# EAGLE design Poseidon (EAGLE 9.6.2)
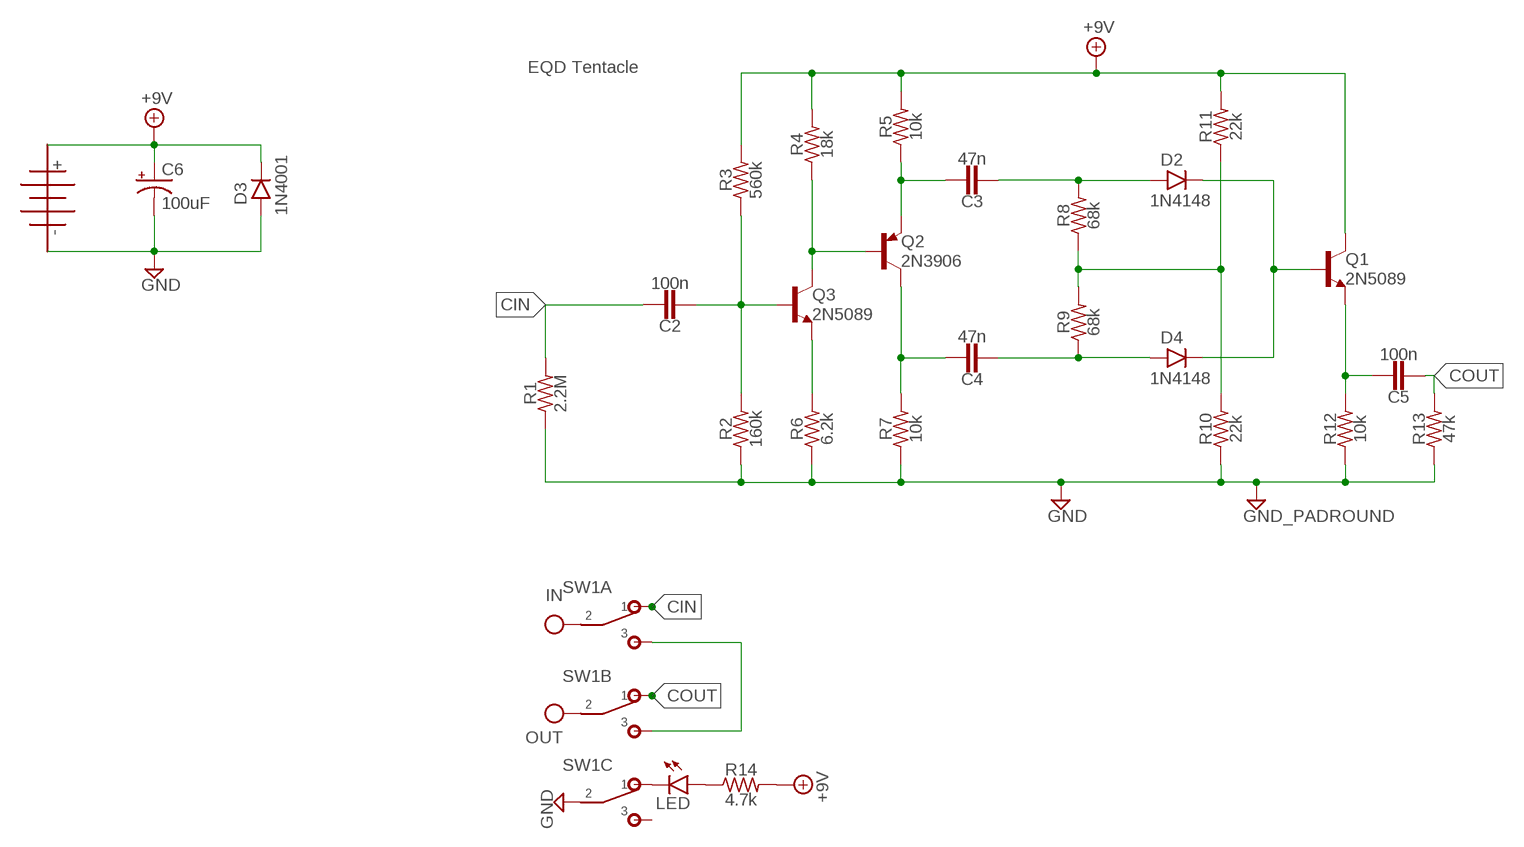
[diagram p0: schematic, sheet 1]

## Parts
C2  100n  CAP.2  [0.2".SML]
C3  47n  CAP.2  [0.2".SML]
C4  47n  CAP.2  [0.2".SML]
C5  100n  CAP.2  [0.2".SML]
C6  100uF  0631  [063_025]
D2  1N4148  DO35.3  [DO35-3]
D3  1N4001  DO41.3  [DO41-3]
D4  1N4148  DO35.3  [DO35-3]
DC  BATTERYBAT2  [BATTERY2]
GND  GND_PADROUND  [ROUND]
IN  IN  [SQUARE]
LED  LED3MM  [LED3MM]
OUT  OUT  [SQUARE]
Q1  2N5089  2N5088  [TO92]
Q2  2N3906  2N5087  [TO92]
Q3  2N5089  2N5088  [TO92]
R1  2.2M  R.3B  [0.3".B]
R2  160k  R.3B  [0.3".B]
R3  560k  R.3B  [0.3".B]
R4  18k  R.3B  [0.3".B]
R5  10k  R.3B  [0.3".B]
R6  6.2k  R.3B  [0.3".B]
R7  10k  R.3B  [0.3".B]
R8  68k  R.3B  [0.3".B]
R9  68k  R.3B  [0.3".B]
R10  22k  R.3B  [0.3".B]
R11  22k  R.3B  [0.3".B]
R12  10k  R.3B  [0.3".B]
R13  47k  R.3B  [0.3".B]
R14  4.7k  R.3B  [0.3".B]
SW1  3PDT  [3PDT]

## Nets
+9V: C6.+ D3.C DC.P$1 Q1.1(C) R3.2 R4.2 R5.2 R11.2 R14.2
CIN: C2.1 R1.2 SW1.A1
COUT: C5.2 R13.2 SW1.B1
GND: C6.- D3.A DC.P$2 GND.1(GND) R1.1 R2.1 R6.1 R7.1 R10.1 R12.1 R13.1 SW1.C2
IN: IN.1(IN) SW1.A2
N$1: SW1.A3 SW1.B3
N$2: C2.2 Q3.2(B) R2.2 R3.1
N$3: LED.K(C) SW1.C1
N$4: Q3.3(E) R6.2
N$5: LED.A R14.1
N$6: Q2.2(B) Q3.1(C) R4.1
N$7: C3.1 Q2.3(E) R5.1
N$9: C4.1 Q2.1(C) R7.2
N$10: C4.2 D4.A R9.1
N$11: R8.1 R9.2 R10.2 R11.1
N$12: C3.2 D2.A R8.2
N$14: D2.C D4.C Q1.2(B)
N$16: C5.1 Q1.3(E) R12.2
OUT: OUT.1(OUT) SW1.B2
Unconnected: SW1.C3

## Notes on the sheet
- EQD Tentacle

## Library data of the parts
C2-C5 = caps-film:CAP: For Ceramic, Film, MLCC caps
C6 = caps-elec:063: 33 - 220uF Xicon values at Mouser.com 10V: 220uF; 16V: 100uF; 25V: 100uF; 50V: 33uF
D2 D4 = diodes:DO35: DO-35 Package Diodes: 1N914
D3 = diodes:DO41: DO-41 Package Diodes: 1N4001 - 1N40019 Zener Diodes: 1N4728 - 1N4764
DC = jacks:BATTERY
GND = supply pins:GND_PAD: Ground use this to hook up ground connections throughout a schematic instead of running wire automatically labels the net "GND"
IN = supply pins:IN: Input obsolete: use Mark instead and label net schematic input label without circuit board terminal/pad labels net "IN" provided as complement to OUT (rarely used)
LED = diodes:LED
OUT = supply pins:OUT: Output obsolete: use Mark instead and label net output label without circuit board terminal/pad commonly used as output label on 2nd lug of a potentiometer
Q1 Q3 = transistors-BJT:2N5088: NPN - 2n5088, 2n5089, 2n3904, MPSA18 [C]-B-E pinout 2n5088: http://smallbear-electronics.mybigcommerce.com/transistor-2n5088/ 2n5089: http://smallbear-electronics.mybigcommerce.com/transistor-2n5089/ 2n5089: http://smallbear-electronics.mybigcommerce.com/transistor-2n5089-motorola/ 2n3904: http://smallbear-electronics.mybigcommerce.com/transistor-2n3904/ MPSA18: http://smallbear-electronics.mybigcommerce.com/transistor-mpsa18/
Q2 = transistors-BJT:2N5087: PNP - 2n5087, 2n3906 [C]-B-E pinout 2n5087: http://smallbear-electronics.mybigcommerce.com/transistor-2n5087/ 2n3906: http://smallbear-electronics.mybigcommerce.com/transistor-2n3906/
R1-R14 = resistors:R: 1/8W, 1/4W and 1W resistors
SW1 = switches:3PDT: Mountain Switch 108-1M31T1B1M1QE-EVX https://www.mouser.com/ProductDetail/Mountain-Switch/108-1M31T1B1M1QE-EVX?qs=sGAEpiMZZMvudeGI7i40XO%252BnGhp8Hy%252BJe46O%2FBjy5XE%3D

## Board
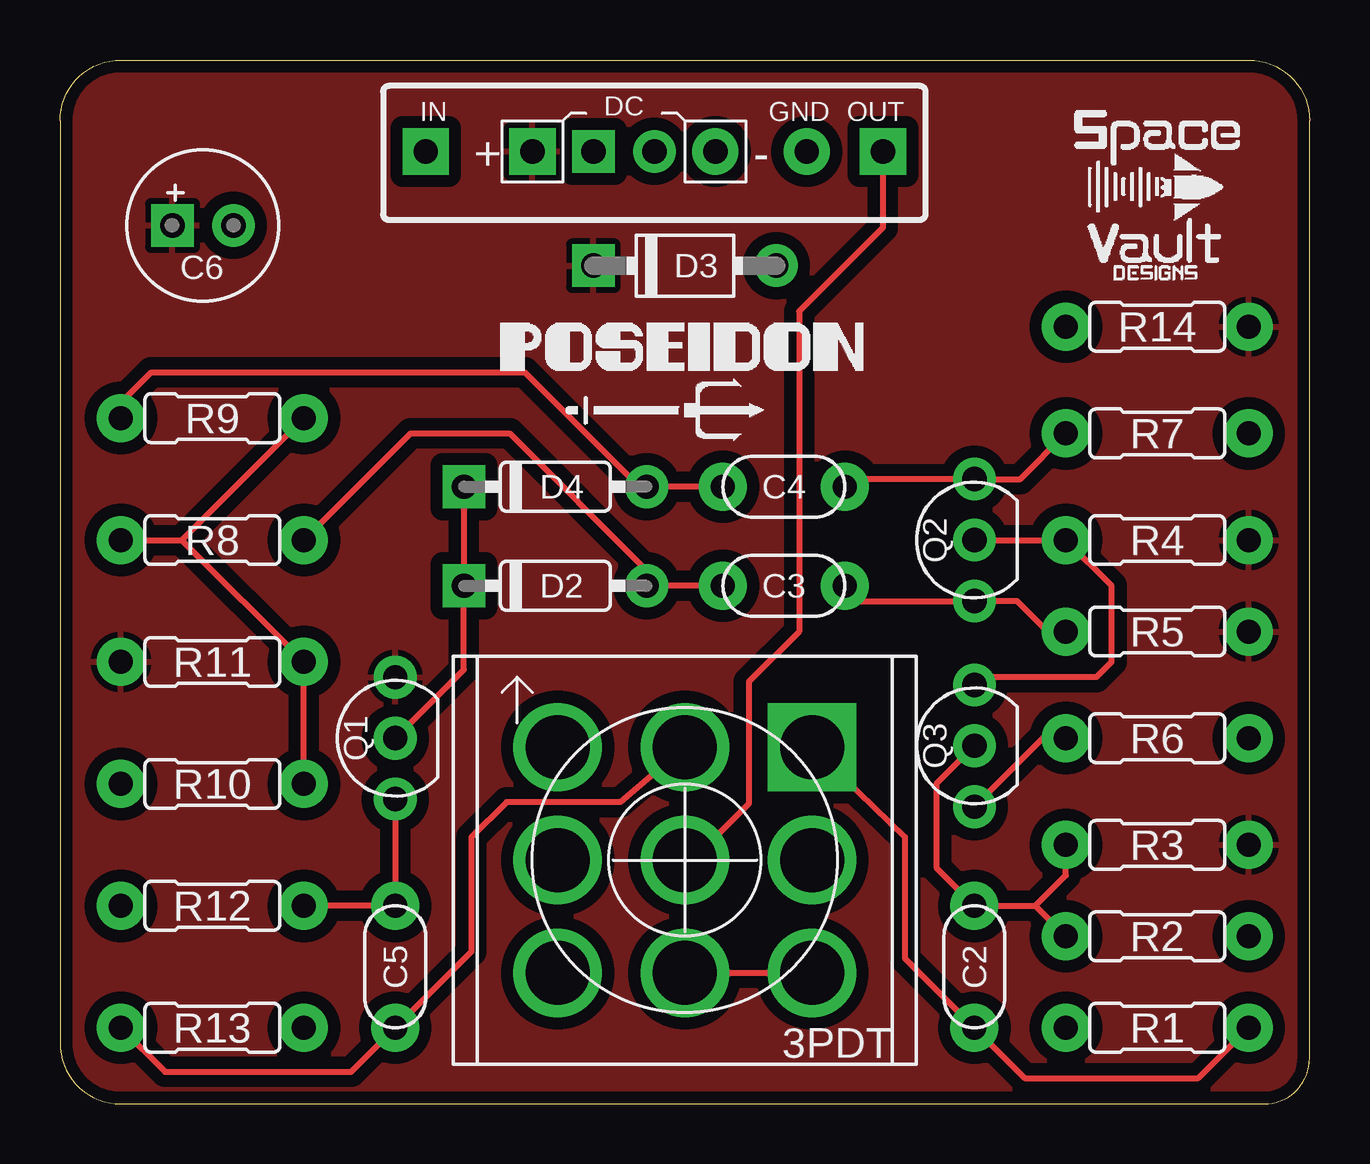
[diagram p1: board, top side]
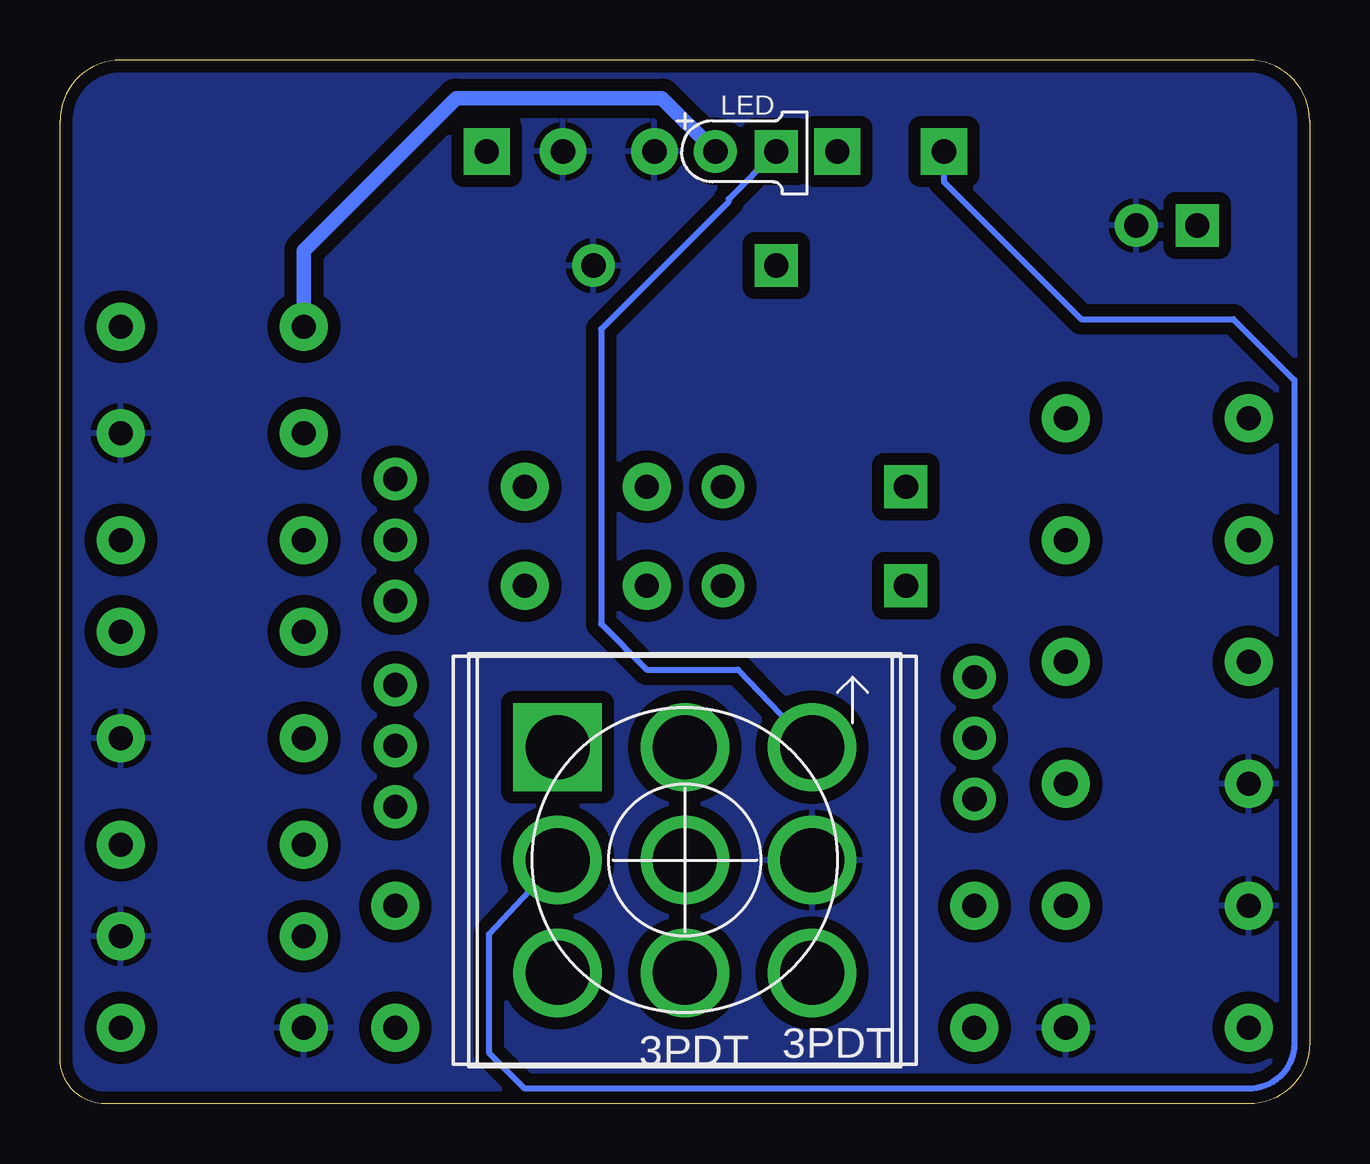
[diagram p2: board, bottom side, seen from below]

Size 52.07 x 43.5 mm. Coordinates in mm from the lower left corner, seen from the top.
Outline: 0,2.54 arc90 2.54,0 50.17,0 arc90 52.07,1.9 52.07,40.96 arc90 49.53,43.5 2.54,43.5 arc90 0,40.96 0,2.54
Copper layers (1*16): Top 0.035mm / dielectric 1.6mm / Bottom 0.035mm
Design rules "Elecrow_2-layer_PCB_eagle_rule": minimum track width 6mil, minimum drill 12mil, track to track 6mil, track to pad 6mil, pad to pad 6mil, via to via 8mil, smd to smd 0mil, copper to edge 20mil, drill to drill 10mil, minimum pad ring 6mil, minimum via ring 6mil, stop-mask expansion 0mil, vias tented up to drill 100mil, thermal gap 10mil

### Footprints (pad centres in the part's own frame; a part is rotated, then mirrored left to right if it is on the bottom)
0.2".SML = drill 1 pad 2: 1 -2.54,0; 2 2.54,0
063_025 = drill 1.016 pad 1.778 square: + -1.27,0 | drill 1.016 pad 1.778: - 1.27,0
DO35-3 = drill 1.016 pad 1.778: A 3.81,0 | drill 1.016 pad 1.778 square: C -3.81,0
DO41-3 = drill 1.016 pad 1.778: A 3.81,0 | drill 1.016 pad 1.778 square: C -3.81,0
BATTERY2 = drill 1.016 pad 1.93 square: P$1 -3.81,0 | drill 1.016 pad 1.93: P$2 3.81,0
ROUND = drill 1.016 pad 1.93: 1 0,0
SQUARE = drill 1.016 pad 1.93 square: 1 0,0
LED3MM = drill 1.016 pad 1.778: A -1.27,0 | drill 1.016 pad 1.778 square: K 1.27,0
TO92 = drill 1.016 pad 1.778: 1 -2.54,0; 2 0,0; 3 2.54,0
0.3".B = drill 1 pad 2: 1 -3.81,0; 2 3.81,0
3PDT = drill 2.667 square: A1 -5.3,4.7 | drill 2.667: A2 -5.3,0; A3 -5.3,-4.7; B1 0,4.7; B2 0,0; B3 0,-4.7; C1 5.3,4.7; C2 5.3,0; C3 5.3,-4.7

### Placement (x,y rotation side)
C2  38.1,5.71 90 top
C3  30.16,21.59 180 top
C4  30.16,25.72 180 top
C5  13.97,5.71 270 top
C6  5.95,36.6 0 top
D2  20.64,21.59 0 top
D3  26.03,34.93 0 top
D4  20.64,25.72 0 top
DC  23.5,39.69 0 top
GND  31.11,39.69 0 top
IN  15.24,39.69 0 top
LED  23.5,39.69 0 bottom
OUT  34.29,39.69 0 top
Q1  13.97,15.24 270 top
Q2  38.1,23.5 270 top
Q3  38.1,14.92 270 top
R1  45.72,3.17 0 top
R2  45.72,6.99 180 top
R3  45.72,10.79 0 top
R4  45.72,23.5 0 top
R5  45.72,19.68 0 top
R6  45.72,15.24 180 top
R7  45.72,27.94 180 top
R8  6.35,23.5 0 top
R9  6.35,28.57 0 top
R10  6.35,13.34 0 top
R11  6.35,18.41 180 top
R12  6.35,8.26 0 top
R13  6.35,3.17 180 top
R14  45.72,32.38 0 top
SW1  26.04,10.16 0 bottom
U$1  [3PDT']  26.03,10.16 0 top

### Tracks (layer width: path | path; a pad name or v marks a point on that pad's centre or on a via)
+9V
  pour Top (isolate 0.508): 0,2.54 0,40.96 arc-90 2.54,43.5 49.53,43.5 arc-90 52.07,40.96 52.07,2.54 arc-90 49.53,0 2.54,0 arc-90
CIN
  Top 0.254: R1.2 47.43,1.08 40.2,1.08 C2.1 35.22,6.06 35.22,11.12 SW1.A1
COUT
  Top 0.254: R13.2 4.38,1.33 12.13,1.33 C5.2 17.15,6.35 17.15,11.11 18.61,12.57 23.35,12.57 SW1.B1
GND
  pour Bottom (isolate 0.508): 0,2.54 0,40.96 arc-90 2.54,43.5 49.53,43.5 arc-90 52.07,40.96 52.07,2.54 arc-90 49.53,0 2.54,0 arc-90
IN
  Bottom 0.254: IN.1 15.24,38.42 9.53,32.7 3.18,32.7 0.64,30.16 0.64,2.54 arc90 2.54,0.63 32.7,0.63 34.2,2.14 34.2,7.07 SW1.A2
N$1
  Top 0.254: SW1.B3 SW1.A3
N$2
  Top 0.254: Q3.2 36.51,13.33 36.51,9.84 C2.2 40.64,8.25 | 40.64,8.25 R2.2 | 40.64,8.25 41.91,9.52 R3.1
N$3
  Bottom 0.254: LED.K 24.22,37.7 24.22,37.59 29.53,32.28 29.53,20 27.62,18.1 23.81,18.1 SW1.C1
N$4
  Top 0.254: R6.2 40.96,15.24 Q3.3
N$5
  Bottom 0.61: LED.A 26.99,41.91 35.56,41.91 41.91,35.56 R14.1
N$6
  Top 0.254: Q2.2 R4.1 43.82,21.59 43.82,18.41 43.18,17.78 38.42,17.78 Q3.1
N$7
  Top 0.254: C3.1 33.34,20.95 Q2.3 39.88,20.95 41.15,19.68 R5.1
N$9
  Top 0.254: R7.2 40.01,26.03 Q2.1 33.02,26.03 C4.1
N$10
  Top 0.254: R9.1 2.54,29.21 3.81,30.48 19.37,30.48 24.13,25.72 D4.A C4.2
N$11
  Top 0.254: R10.2 R11.1 5.08,23.49 | 5.08,23.49 R9.2 | R8.1 5.08,23.49
N$12
  Top 0.254: C3.2 D2.A 24.45,22.22 18.73,27.94 14.61,27.94 R8.2
N$14
  Top 0.254: D4.C D2.C 16.83,18.1 Q1.2
N$16
  Top 0.254: R12.2 C5.1 Q1.3
OUT
  Top 0.254: OUT.1 34.29,36.51 30.8,33.02 30.8,19.68 28.7,17.59 28.7,12.51 26.35,10.16 SW1.B2

### Text on the board
bPlace: 3PDT